# Altium schematic sheet Sheet_ESP8266_SIM800C.SchDoc
size A4; SheetNumber: 2; SheetTotal: 4
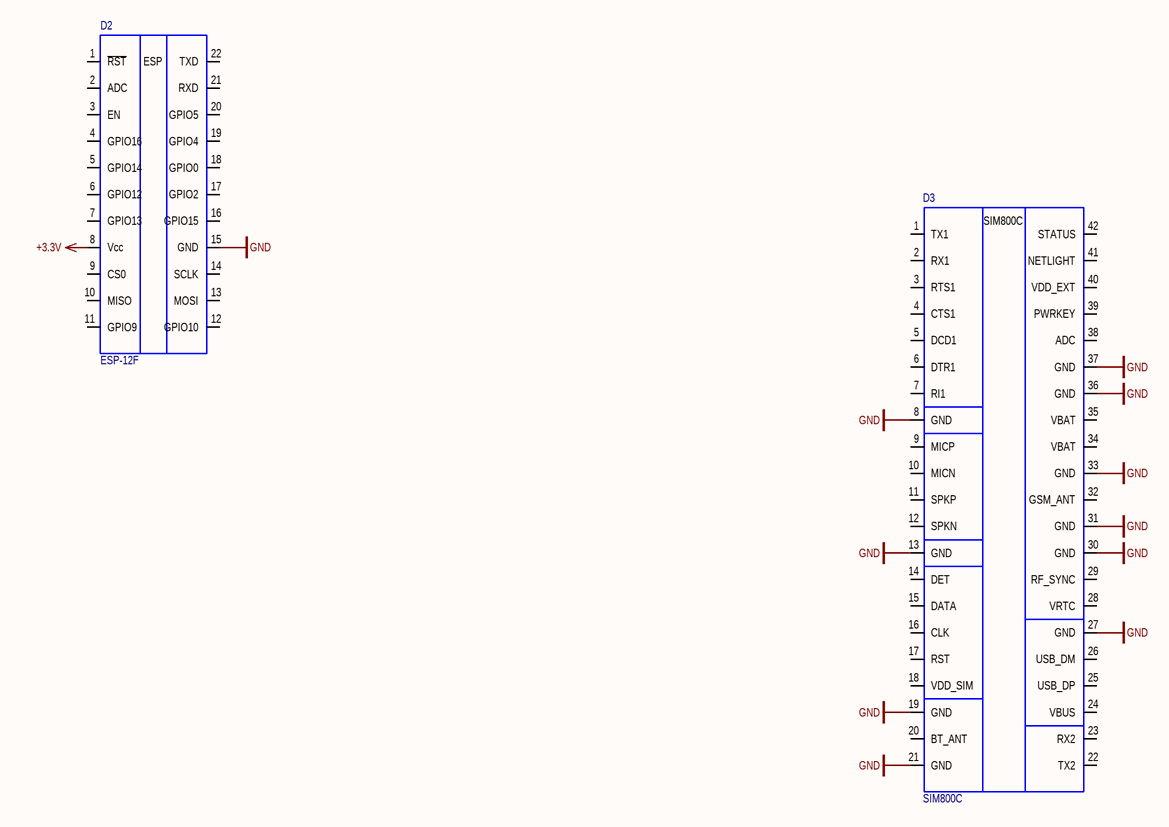
[diagram p0: Sheet_ESP8266_SIM800C.SchDoc]

## Parts
D2  ESP-12F  [ESP8266 ESP-12-E]
D3  SIM800C  [SIM800C]

## Nets
+3.3V: D2.8(Vcc)
GND: D2.15(GND) D3.8(GND) D3.13(GND) D3.19(GND) D3.21(GND) D3.27(GND) D3.30(GND) D3.31(GND) D3.33(GND) D3.36(GND) D3.37(GND)

Not connected (* = marked no-connect by the designer): D2 1(~{RST}) 2(ADC) 3(EN) 4(GPIO16) 5(GPIO14) 6(GPIO12) 7(GPIO13) 9(CS0) 10(MISO) 11(GPIO9) 12(GPIO10) 13(MOSI) 14(SCLK) 16(GPIO15) 17(GPIO2) 18(GPIO0) 19(GPIO4) 20(GPIO5) 21(RXD) 22(TXD); D3 1(TX1) 2(RX1) 3(RTS1) 4(CTS1) 5(DCD1) 6(DTR1) 7(RI1) 9(MICP) 10(MICN) 11(SPKP) 12(SPKN) 14(DET) 15(DATA) 16(CLK) 17(RST) 18(VDD_SIM) 20(BT_ANT) 22(TX2) 23(RX2) 24(VBUS) 25(USB_DP) 26(USB_DM) 28(VRTC) 29(RF_SYNC) 32(GSM_ANT) 34(VBAT) 35(VBAT) 38(ADC) 39(PWRKEY) 40(VDD_EXT) 41(NETLIGHT) 42(STATUS)

## Notes on the sheet
- (in symbol ESP-12F) ESP